# Altium project MainBoard.PrjPCB
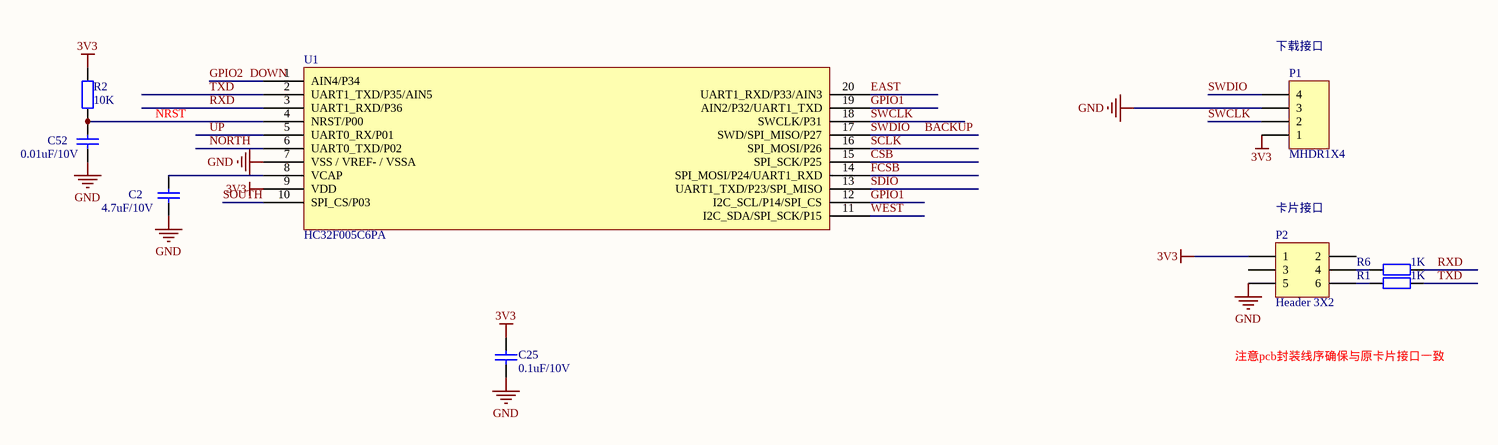
[diagram p0: mcu.SchDoc]
3 sheets, 102 parts. Net scope: global (net labels, ports and power ports of the same name join across sheets).
Sheets:
  mcu.SchDoc
  RF.SchDoc
  power.SchDoc

## Sheet mcu.SchDoc
size A3

### Parts
C2  4.7uF/10V  [0603C]
C25  0.1uF/10V  [0603C]
C52  0.01uF/10V  [0603C]
P1  MHDR1X4  [SIP4]
P2  Header 3X2
R1  1K  [0603R]
R2  10K  [0603R]
R6  1K  [0603R]
U1  HC32F005C6PA

### Nets
3V3: C25.1 P1.1 P2.1 R2.2 U1.9(VDD)
GND: C2.2 C25.2 C52.2 P1.3 P2.5 U1.7(VSS_/_VREF-_/_VSSA)
BACKUP: P1.4 U1.17(SWD/SPI_MISO/P27)  [also labelled SWDIO]
CSB: U1.15(SPI_SCK/P25)
DOWN: U1.1(AIN4/P34)  [also labelled GPIO2]
EAST: U1.20(UART1_RXD/P33/AIN3)
FCSB: U1.14(SPI_MOSI/P24/UART1_RXD)
GPIO1: U1.12(I2C_SCL/P14/SPI_CS) U1.19(AIN2/P32/UART1_TXD)
NORTH: U1.6(UART0_TXD/P02)
NRST: C52.1 R2.1 U1.4(NRST/P00)
RXD: R6.1 U1.3(UART1_RXD/P36)
SCLK: U1.16(SPI_MOSI/P26)
SDIO: U1.13(UART1_TXD/P23/SPI_MISO)
SOUTH: U1.10(SPI_CS/P03)
SWCLK: P1.2 U1.18(SWCLK/P31)
TXD: R1.1 U1.2(UART1_TXD/P35/AIN5)
UP: U1.5(UART0_RX/P01)
WEST: U1.11(I2C_SDA/SPI_SCK/P15)
NetC2_1: C2.1 U1.8(VCAP)
NetP2_4: P2.4 R6.2
NetP2_6: P2.6 R1.2

Not connected (* = marked no-connect by the designer): P2 2 3

### Notes on the sheet
- (near P1) 下载接口
- (near P2) 卡片接口
- 注意pcb封装线序确保与原卡片接口一致

### Library data of the parts
C2 C25 C52 = Cap: Capacitor; Value: 106; Published: 8-Jun-2000; LatestRevisionDate: 17-Jul-2002; LatestRevisionNote: Re-released for DXP Platform.; PackageReference: RAD-0.3; Publisher: Altium Limited
P1 = MHDR1X4: Header, 4-Pin; LatestRevisionDate: 17-Jul-2002; LatestRevisionNote: Re-released for DXP Platform.; Publisher: Altium Limited
P2 = Header 3X2: Header, 3-Pin, Dual row; LatestRevisionDate: 17-Jul-2002; LatestRevisionNote: Re-released for DXP Platform.; Publisher: Altium Limited
R1 R2 R6 = Res2: Resistor; Value: 10K/5%/1/8W; Published: 8-Jun-2000; LatestRevisionDate: 17-Jul-2002; LatestRevisionNote: Re-released for DXP Platform.; PackageReference: AXIAL-0.4; Publisher: Altium Limited

## Sheet RF.SchDoc
size A3
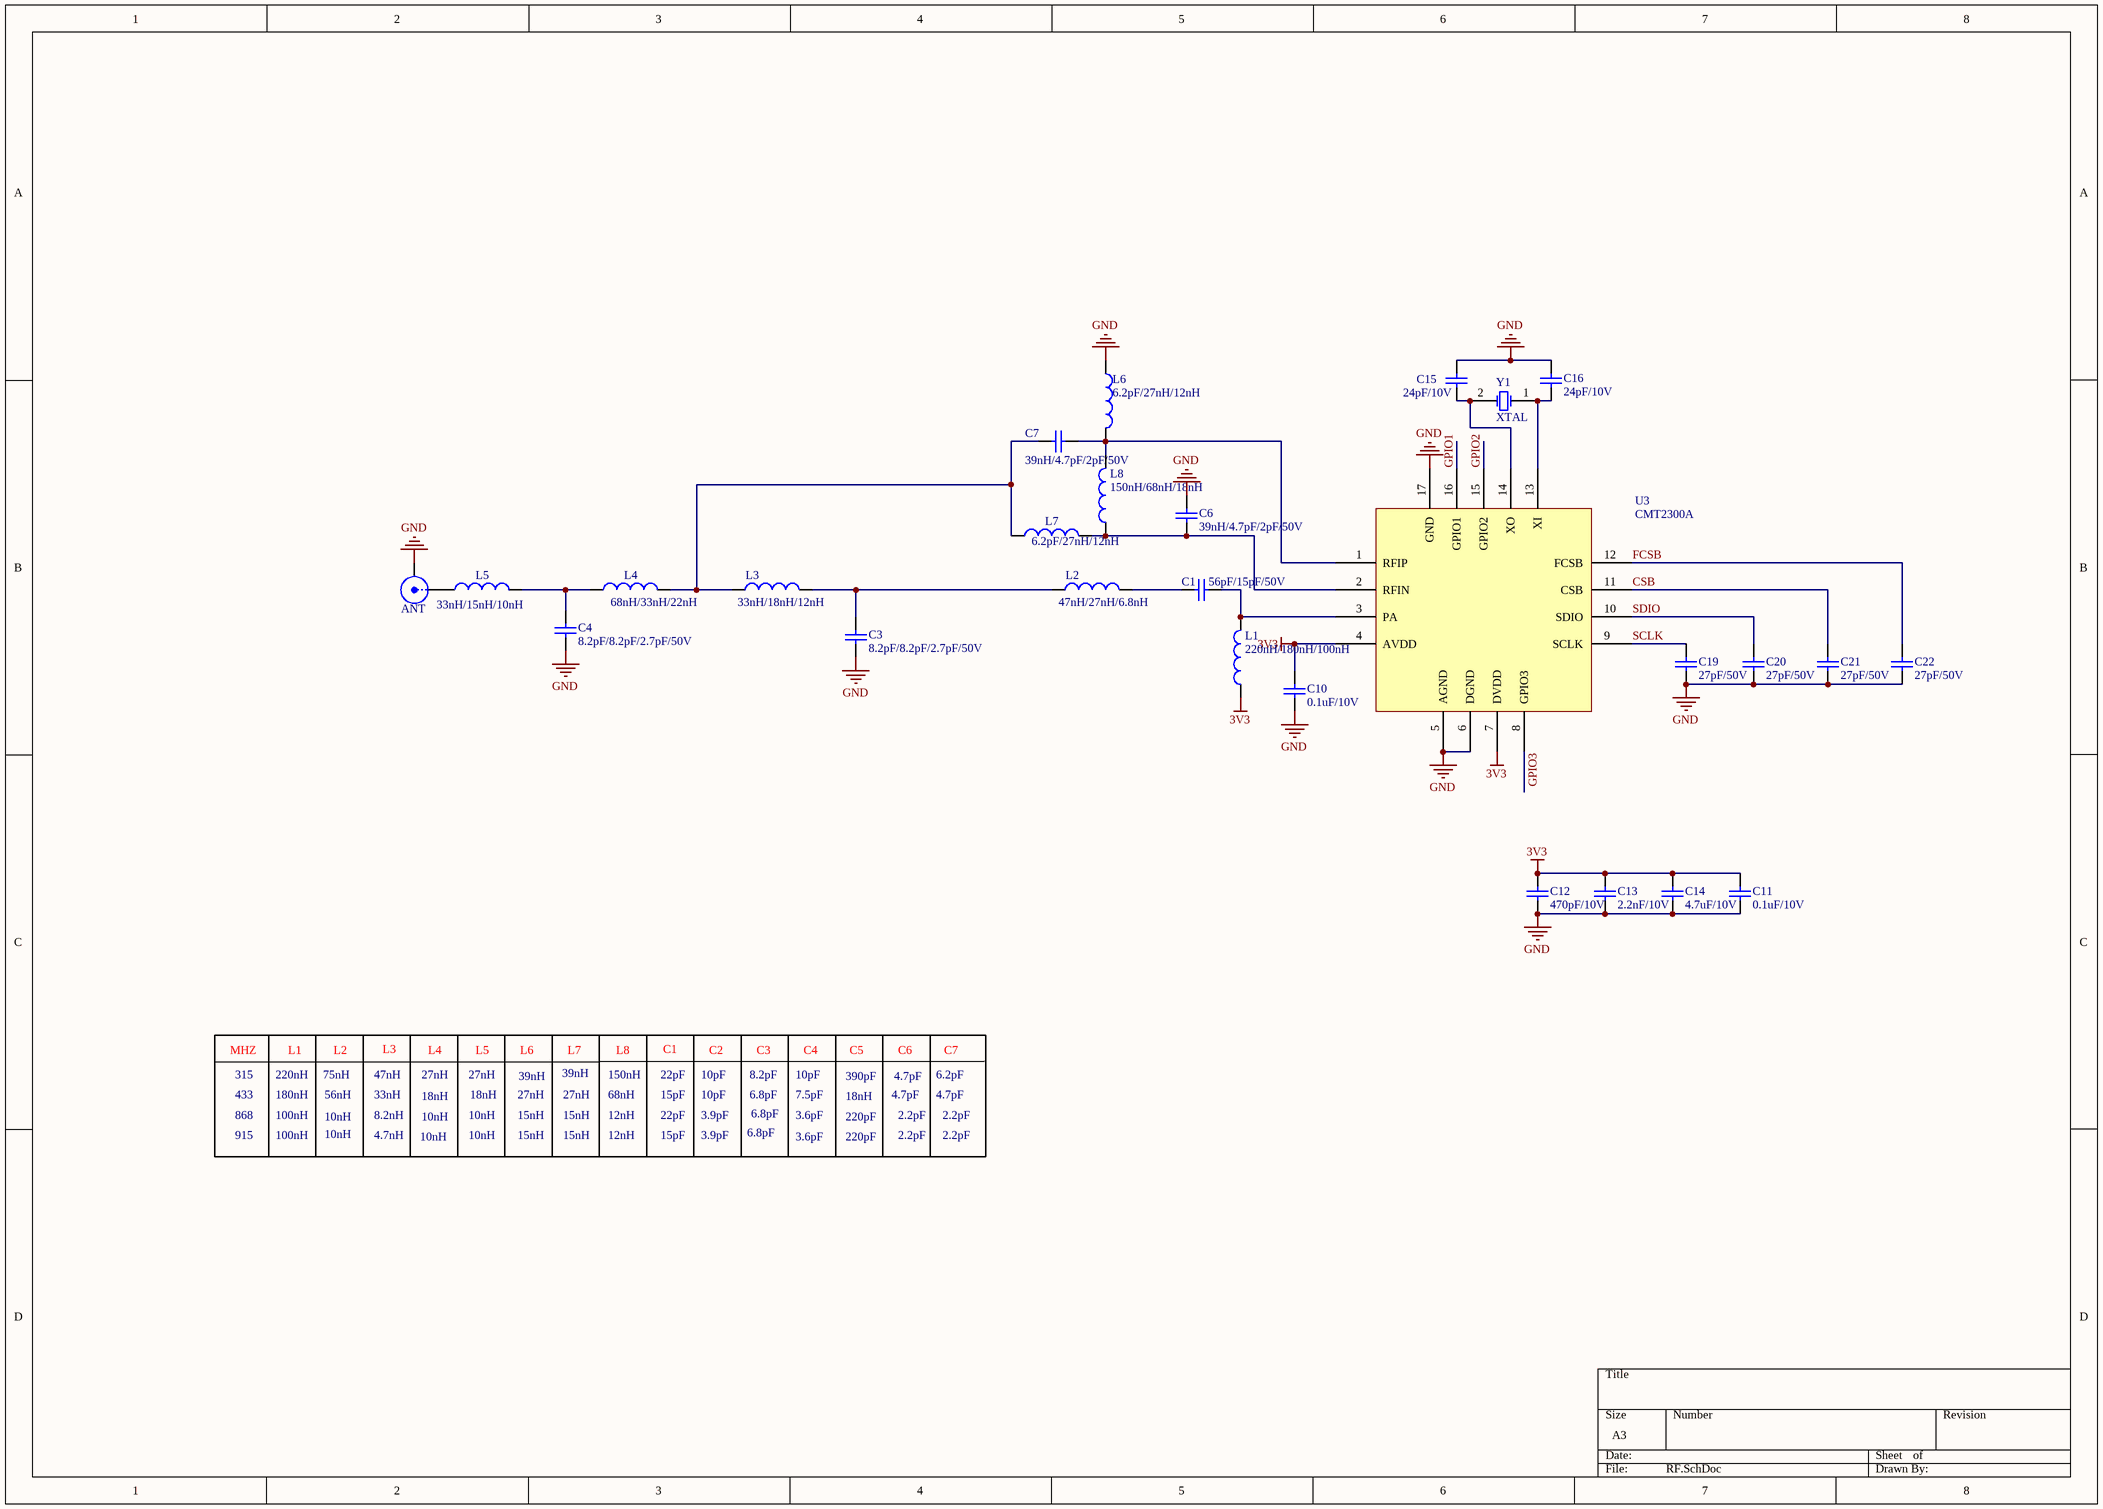
[diagram p1: RF.SchDoc]

### Parts
ANT  (no value)  [SMA Straight SMD]
C1  56pF/15pF/50V  [0603C]
C3  8.2pF/8.2pF/2.7pF/50V  [0603C]
C4  8.2pF/8.2pF/2.7pF/50V  [0603C]
C6  39nH/4.7pF/2pF/50V  [0603C]
C7  39nH/4.7pF/2pF/50V  [0603C]
C10  0.1uF/10V  [0603C]
C11  0.1uF/10V  [0603C]
C12  470pF/10V  [0603C]
C13  2.2nF/10V  [0603C]
C14  4.7uF/10V  [0603C]
C15  24pF/10V  [0603C]
C16  24pF/10V  [0603C]
C19  27pF/50V  [0603C]
C20  27pF/50V  [0603C]
C21  27pF/50V  [0603C]
C22  27pF/50V  [0603C]
L1  220nH/180nH/100nH  [0603R]
L2  47nH/27nH/6.8nH  [0603R]
L3  33nH/18nH/12nH  [0603R]
L4  68nH/33nH/22nH  [0603R]
L5  33nH/15nH/10nH  [0603R]
L6  6.2pF/27nH/12nH  [0603R]
L7  6.2pF/27nH/12nH  [0603R]
L8  150nH/68nH/18nH  [0603R]
U3  CMT2300A
Y1  XTAL  [BCY-W2/D3.1]

### Nets
3V3: C10.1 C11.1 C12.1 C13.1 C14.1 L1.1 U3.4(AVDD) U3.7(DVDD)
GND: ANT.2(GND) C3.2 C4.2 C6.2 C10.2 C11.2 C12.2 C13.2 C14.2 C15.1 C16.1 C19.2 C20.2 C21.2 C22.2 L6.1 U3.5(AGND) U3.6(DGND) U3.17(GND)
CSB: C21.1 U3.11(CSB)
FCSB: C22.1 U3.12(FCSB)
GPIO1: U3.16(GPIO1)
GPIO2: U3.15(GPIO2)  [project net DOWN]
GPIO3: U3.8(GPIO3)
SCLK: C19.1 U3.9(SCLK)
SDIO: C20.1 U3.10(SDIO)
NetANT_1: ANT.1(Signal) L5.1
NetC1_1: C1.1 L2.2
NetC1_2: C1.2 L1.2 U3.3(PA)
NetC3_1: C3.1 L2.1 L3.2
NetC4_1: C4.1 L4.1 L5.2
NetC6_1: C6.1 L7.2 L8.1 U3.2(RFIN)
NetC7_1: C7.1 L3.1 L4.2 L7.1
NetC7_2: C7.2 L6.2 L8.2 U3.1(RFIP)
NetC15_2: C15.2 U3.14(XO) Y1.2(OSC2)
NetC16_2: C16.2 U3.13(XI) Y1.1(OSC1)

### Notes on the sheet
- MHZ
- L1
- L2
- L3
- L4
- L5
- L6
- L7
- L8
- C1
- C2
- C3
- C4
- C5
- C6
- C7
- 315
- 433
- 868
- 220nH
- 180nH
- 100nH
- 75nH
- 56nH
- 10nH
- 47nH
- 33nH
- 8.2nH
- 27nH
- 18nH
- 15nH
- 39nH
- 150nH
- 68nH
- 12nH
- 22pF
- 15pF
- 10pF
- 3.9pF
- 8.2pF
- 6.8pF
- 7.5pF
- 3.6pF
- 390pF
- 220pF
- 4.7pF
- 2.2pF
- 6.2pF
- 915
- 4.7nH

### Library data of the parts
ANT = SMA: SMA Straight Connector; LatestRevisionDate: 05-oct-2007  -  Semtech; LatestRevisionNote: Re-released for DXP Platform.; Publisher: Altium Limited
C1 C3 C4 C6 C7 C10-C16 C19-C22 = Cap: Capacitor; Value: 106; Published: 8-Jun-2000; LatestRevisionDate: 17-Jul-2002; LatestRevisionNote: Re-released for DXP Platform.; PackageReference: RAD-0.3; Publisher: Altium Limited
L1-L8 = Inductor: Code_IEC: 1005; Value: 10mH; Published: 8-Jun-2000; LatestRevisionDate: 29-May-2009; LatestRevisionNote: IPC-7351 Footprint Added.; PackageReference: 0402-A; Publisher: Altium Limited; PackageDescription: Chip Inductor; Code_JEITA: 0402
Y1 = XTAL: Crystal Oscillator; Published: 8-Jun-2000; LatestRevisionDate: 17-Jul-2002; LatestRevisionNote: Re-released for DXP Platform.; PackageReference: R38; Publisher: Altium Limited

## Sheet power.SchDoc
size A2
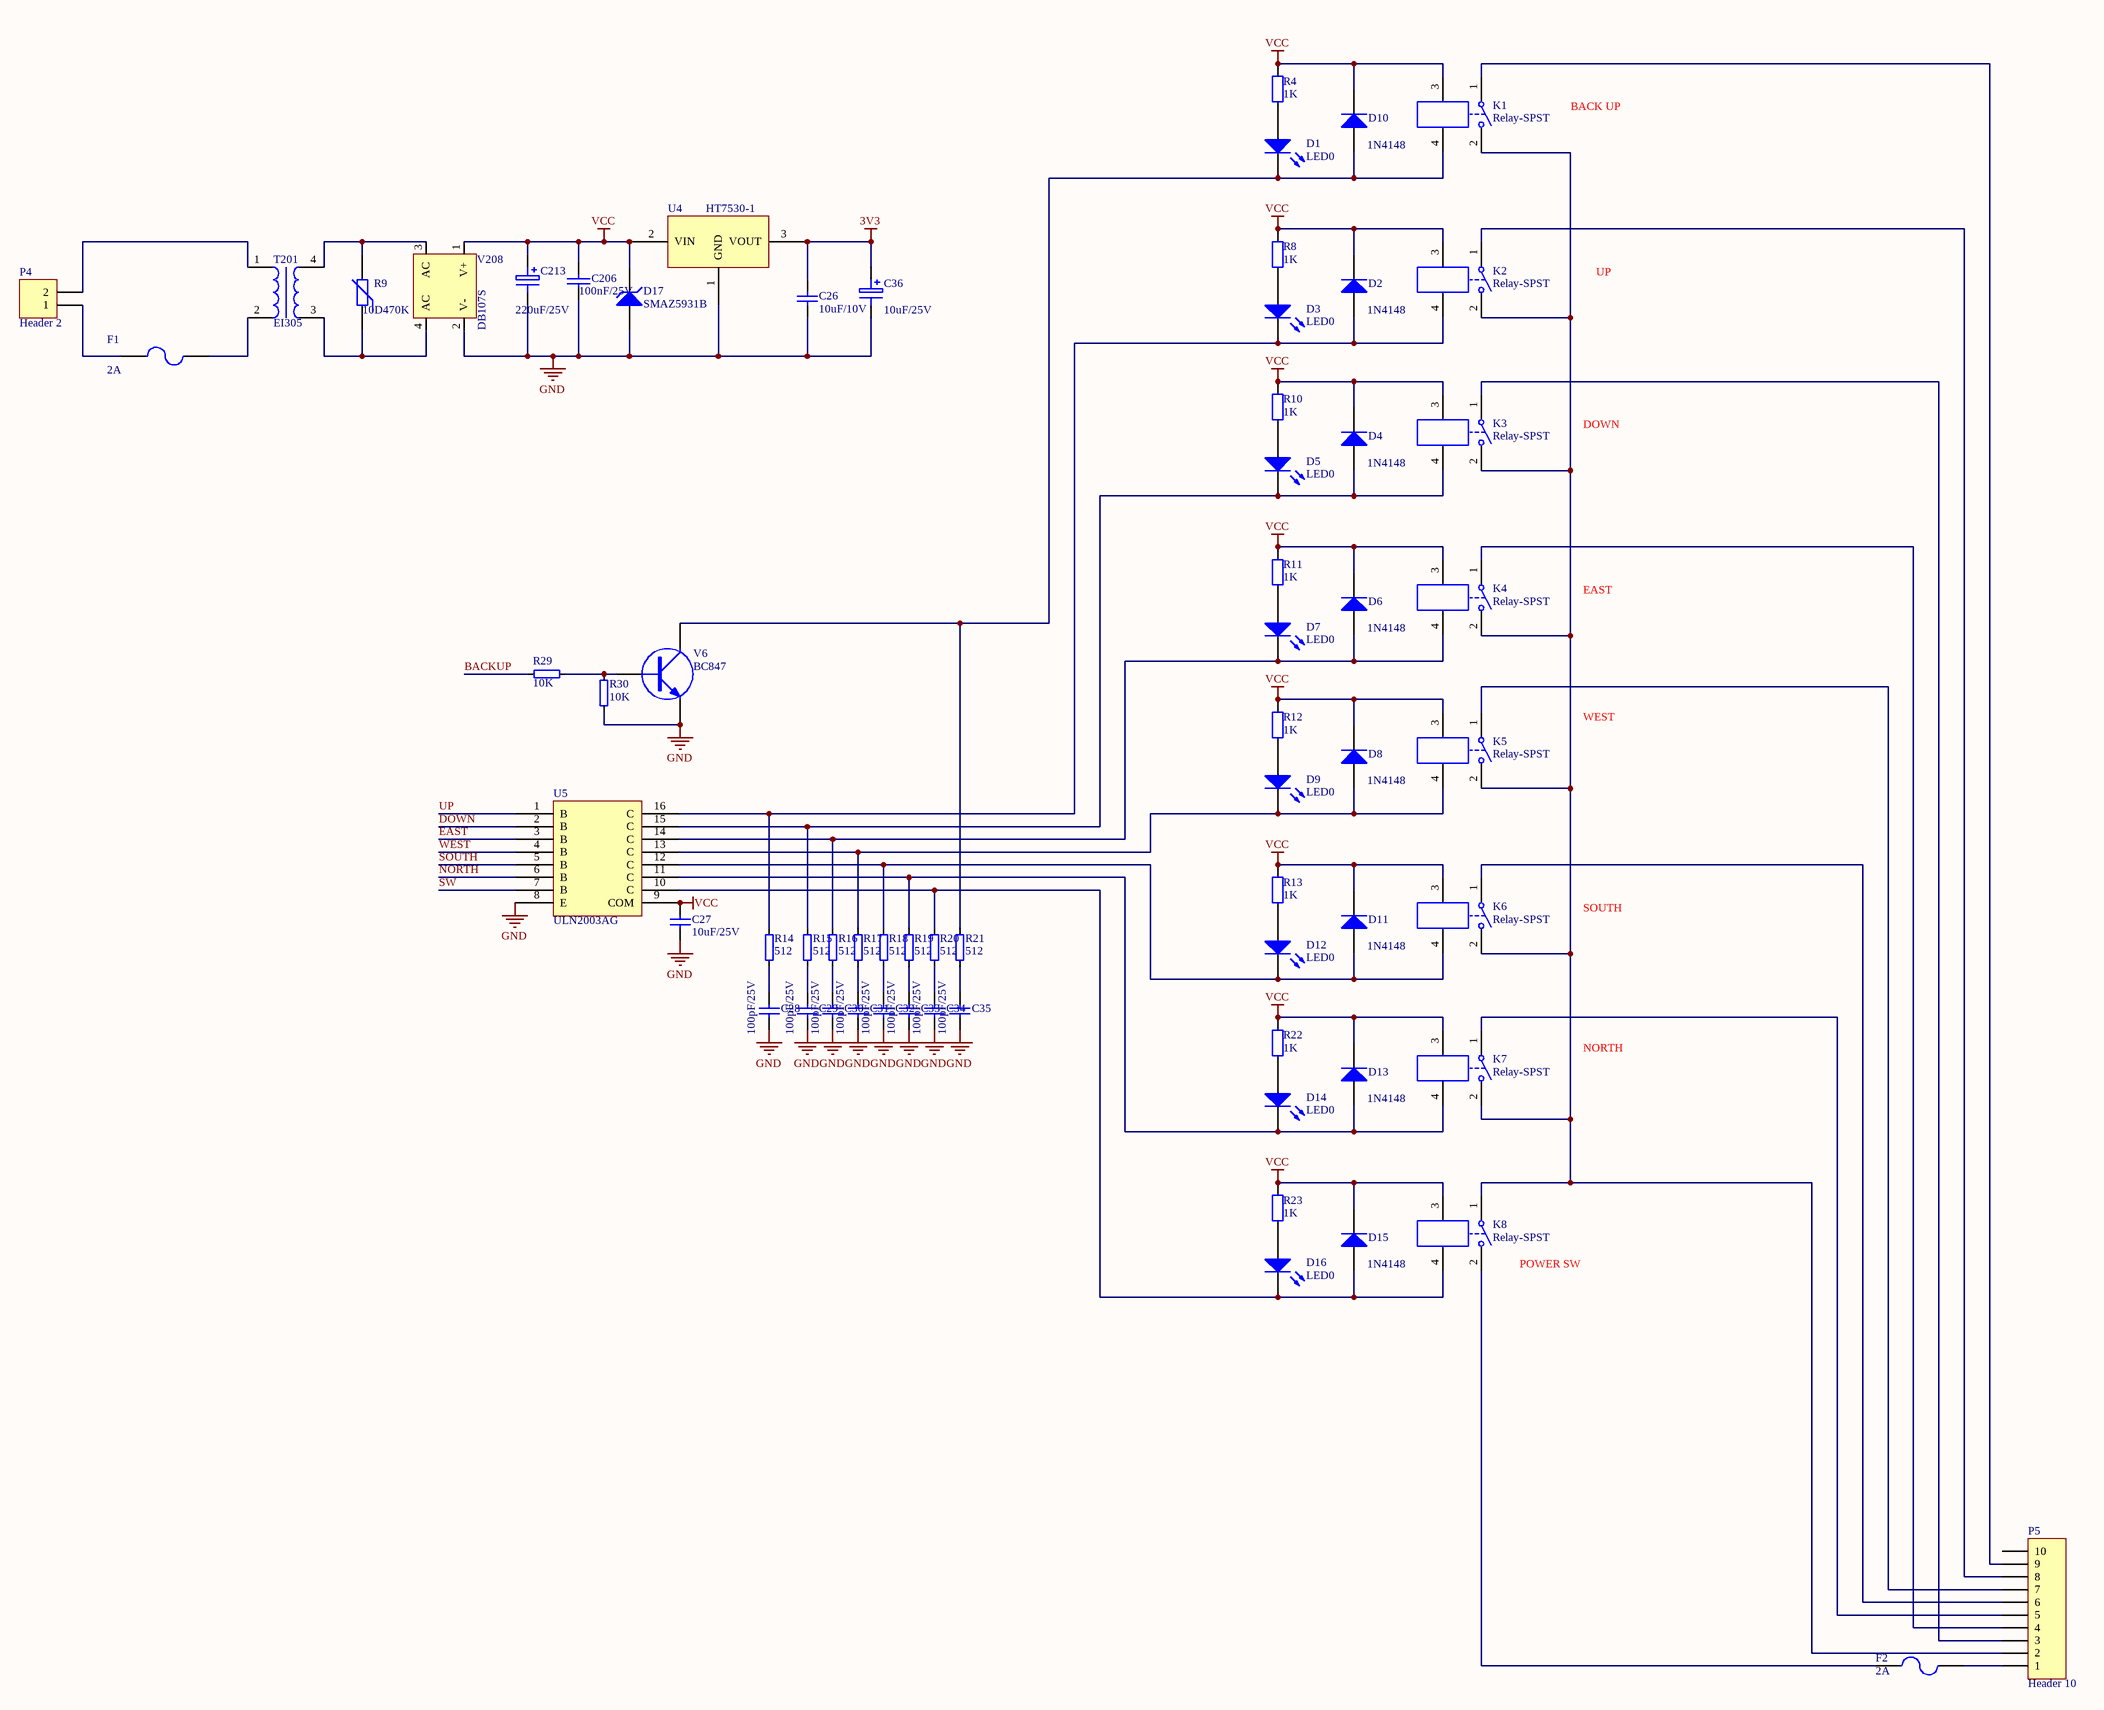
[diagram p2: power.SchDoc]

### Parts
C26  10uF/10V  [0603C]
C27  10uF/25V
C28  100pF/25V
C29  100pF/25V
C30  100pF/25V
C31  100pF/25V
C32  100pF/25V
C33  100pF/25V
C34  100pF/25V
C35  100pF/25V
C36  10uF/25V
C206  100nF/25V
C213  220uF/25V
D1  LED0  [0603led]
D2  1N4148  [SMD-D]
D3  LED0  [0603led]
D4  1N4148  [SMD-D]
D5  LED0  [0603led]
D6  1N4148  [SMD-D]
D7  LED0  [0603led]
D8  1N4148  [SMD-D]
D9  LED0  [0603led]
D10  1N4148  [SMD-D]
D11  1N4148  [SMD-D]
D12  LED0  [0603led]
D13  1N4148  [SMD-D]
D14  LED0  [0603led]
D15  1N4148  [SMD-D]
D16  LED0  [0603led]
D17  SMAZ5931B  [SMA]
F1  2A  [FU]
F2  2A  [FU]
K1  Relay-SPST  [KKK]
K2  Relay-SPST  [KKK]
K3  Relay-SPST  [KKK]
K4  Relay-SPST  [KKK]
K5  Relay-SPST  [KKK]
K6  Relay-SPST  [KKK]
K7  Relay-SPST  [KKK]
K8  Relay-SPST  [KKK]
P4  Header 2  [CH022]
P5  Header 10  [CN10]
R4  1K  [0603R]
R8  1K  [0603R]
R9  10D470K
R10  1K  [0603R]
R11  1K  [0603R]
R12  1K  [0603R]
R13  1K  [0603R]
R14  512  [0603R]
R15  512  [0603R]
R16  512  [0603R]
R17  512  [0603R]
R18  512  [0603R]
R19  512  [0603R]
R20  512  [0603R]
R21  512  [0603R]
R22  1K  [0603R]
R23  1K  [0603R]
R29  10K  [0603R]
R30  10K  [0603R]
T201  EI305  [T01]
U4  HT7530-1
U5  ULN2003AG
V6  BC847  [SOT-23]
V208  DB107S  [BRIDGE]

### Nets
3V3: C26.1 C36.1 U4.3(VOUT)
GND: C26.2 C27.2 C28.2 C29.2 C30.2 C31.2 C32.2 C33.2 C34.2 C35.2 C36.2 C206.2 C213.2 D17.1(A) R30.2 U4.1(GND) U5.8(E) V6.2(E) V208.2(V-)
VCC: C27.1 C206.1 C213.1 D2.2(K) D4.2(K) D6.2(K) D8.2(K) D10.2(K) D11.2(K) D13.2(K) D15.2(K) D17.2(K) K1.3 K2.3 K3.3 K4.3 K5.3 K6.3 K7.3 K8.3 R4.2 R8.2 R10.2 R11.2 R12.2 R13.2 R22.2 R23.2 U4.2(VIN) U5.9(COM) V208.1(V+)
BACKUP: R29.1
DOWN: U5.2(B)
EAST: U5.3(B)
NORTH: U5.6(B)
SOUTH: U5.5(B)
SW: U5.7(B)
UP: U5.1(B)
WEST: U5.4(B)
NetC28_1: C28.1 R14.2
NetC29_1: C29.1 R15.2
NetC30_1: C30.1 R16.2
NetC31_1: C31.1 R17.2
NetC32_1: C32.1 R18.2
NetC33_1: C33.1 R19.2
NetC34_1: C34.1 R20.2
NetC35_1: C35.1 R21.2
NetD1_1: D1.1(A) R4.1
NetD1_2: D1.2(K) D10.1(A) K1.4 R21.1 V6.3(C)
NetD2_1: D2.1(A) D3.2(K) K2.4 R14.1 U5.16(C)
NetD3_1: D3.1(A) R8.1
NetD4_1: D4.1(A) D5.2(K) K3.4 R15.1 U5.15(C)
NetD5_1: D5.1(A) R10.1
NetD6_1: D6.1(A) D7.2(K) K4.4 R16.1 U5.14(C)
NetD7_1: D7.1(A) R11.1
NetD8_1: D8.1(A) D9.2(K) K5.4 R17.1 U5.13(C)
NetD9_1: D9.1(A) R12.1
NetD11_1: D11.1(A) D12.2(K) K6.4 R18.1 U5.12(C)
NetD12_1: D12.1(A) R13.1
NetD13_1: D13.1(A) D14.2(K) K7.4 R19.1 U5.11(C)
NetD14_1: D14.1(A) R22.1
NetD15_1: D15.1(A) D16.2(K) K8.4 R20.1 U5.10(C)
NetD16_1: D16.1(A) R23.1
NetF1_1: F1.1 P4.1
NetF1_2: F1.2 T201.2
NetF2_1: F2.1 K8.2
NetF2_2: F2.2 P5.1
NetK1_1: K1.1 P5.9
NetK1_2: K1.2 K2.2 K3.2 K4.2 K5.2 K6.2 K7.2 K8.1 P5.2
NetK2_1: K2.1 P5.8
NetK3_1: K3.1 P5.3
NetK4_1: K4.1 P5.4
NetK5_1: K5.1 P5.7
NetK6_1: K6.1 P5.6
NetK7_1: K7.1 P5.5
NetP4_2: P4.2 T201.1
NetR9_1: R9.1 T201.3 V208.4(AC)
NetR9_2: R9.2 T201.4 V208.3(AC)
NetR29_2: R29.2 R30.1 V6.1(B)

Not connected (* = marked no-connect by the designer): P5 10

### Notes on the sheet
- BACK UP
- UP
- DOWN
- EAST
- WEST
- SOUTH
- NORTH
- (near K8) POWER SW

### Library data of the parts
C26-C35 = Cap: Capacitor; Value: 106; Published: 8-Jun-2000; LatestRevisionDate: 17-Jul-2002; LatestRevisionNote: Re-released for DXP Platform.; PackageReference: RAD-0.3; Publisher: Altium Limited
C36 C213 = ELECTRO1: Electrolytic Capacitor
C206 = CAP: Capacitor
D1 D3 D5 D7 D9 D12 D14 D16 = LED0: Typical INFRARED GaAs LED; Published: 8-Jun-2000; LatestRevisionDate: 08-Jul-2005; LatestRevisionNote: Mech Layer 1 removed.; PackageReference: LED-0; Publisher: Altium Limited
D2 D4 D6 D8 D10 D11 D13 D15 = Diode: Default Diode; Published: 8-Jun-2000; LatestRevisionDate: 17-Jul-2002; LatestRevisionNote: Re-released for DXP Platform.; PackageVersion: Sep-1996; PackageReference: SMC; Publisher: Altium Limited; Code_JEDEC: DO-214-AB
D17 = D Zener: Zener Diode; Published: 8-Jun-2000; LatestRevisionDate: 17-Jul-2002; LatestRevisionNote: Re-released for DXP Platform.; PackageReference: DIODE-0.7; Publisher: Altium Limited
F1 F2 = Fuse 2: Fuse; Published: 8-Jun-2000; LatestRevisionDate: 17-Jul-2002; LatestRevisionNote: Re-released for DXP Platform.; PackageReference: PIN-W2/E2.8; Publisher: Altium Limited
K1-K8 = Relay-SPST: Single-Pole Single-Throw Relay; Published: 24-Mar-1999; LatestRevisionDate: 17-Jul-2002; LatestRevisionNote: Re-released for DXP Platform.; PackageReference: MODULE4; Publisher: Altium Limited
P4 = Header 2: Header, 2-Pin; LatestRevisionDate: 17-Jul-2002; LatestRevisionNote: Re-released for DXP Platform.; Publisher: Altium Limited
P5 = Header 10: Header, 10-Pin; LatestRevisionDate: 17-Jul-2002; LatestRevisionNote: Re-released for DXP Platform.; Publisher: Altium Limited
R4 R8 R10-R13 R22 R23 = Res2: Resistor; Value: 10K/5%/1/8W; Published: 8-Jun-2000; LatestRevisionDate: 17-Jul-2002; LatestRevisionNote: Re-released for DXP Platform.; PackageReference: AXIAL-0.4; Publisher: Altium Limited
R9 = Res Varistor: Varistor (Voltage-Sensitive Resistor); Published: 24-Mar-1999; LatestRevisionDate: 29-May-2009; LatestRevisionNote: IPC-7351 Footprint Added.; PackageVersion: Mar-2003; PackageReference: 6-0805; Publisher: Altium Limited; PackageDescription: Chip Resistor 0805 Case Size; Code_IPC: RESC2012
R14-R21 R29 R30 = RES2
U4 = HT7533-1
V6 = NPN: NPN Transistor
V208 = BRIDGE2: Diode Bridge

## Nets that join several sheets
3V3: mcu (5 pins), RF (8 pins), power (C26.1 C36.1 U4.3)
GND: mcu (6 pins), RF (19 pins), power (19 pins)
BACKUP: mcu (P1.4 U1.17), power (R29.1)
CSB: mcu (U1.15), RF (C21.1 U3.11)
DOWN: mcu (U1.1), RF (U3.15), power (U5.2)
EAST: mcu (U1.20), power (U5.3)
FCSB: mcu (U1.14), RF (C22.1 U3.12)
GPIO1: mcu (U1.12 U1.19), RF (U3.16)
NORTH: mcu (U1.6), power (U5.6)
SCLK: mcu (U1.16), RF (C19.1 U3.9)
SDIO: mcu (U1.13), RF (C20.1 U3.10)
SOUTH: mcu (U1.10), power (U5.5)
UP: mcu (U1.5), power (U5.1)
WEST: mcu (U1.11), power (U5.4)